# Altium schematic sheet MCU.SchDoc
size A3; SheetNumber: 3; SheetTotal: 7
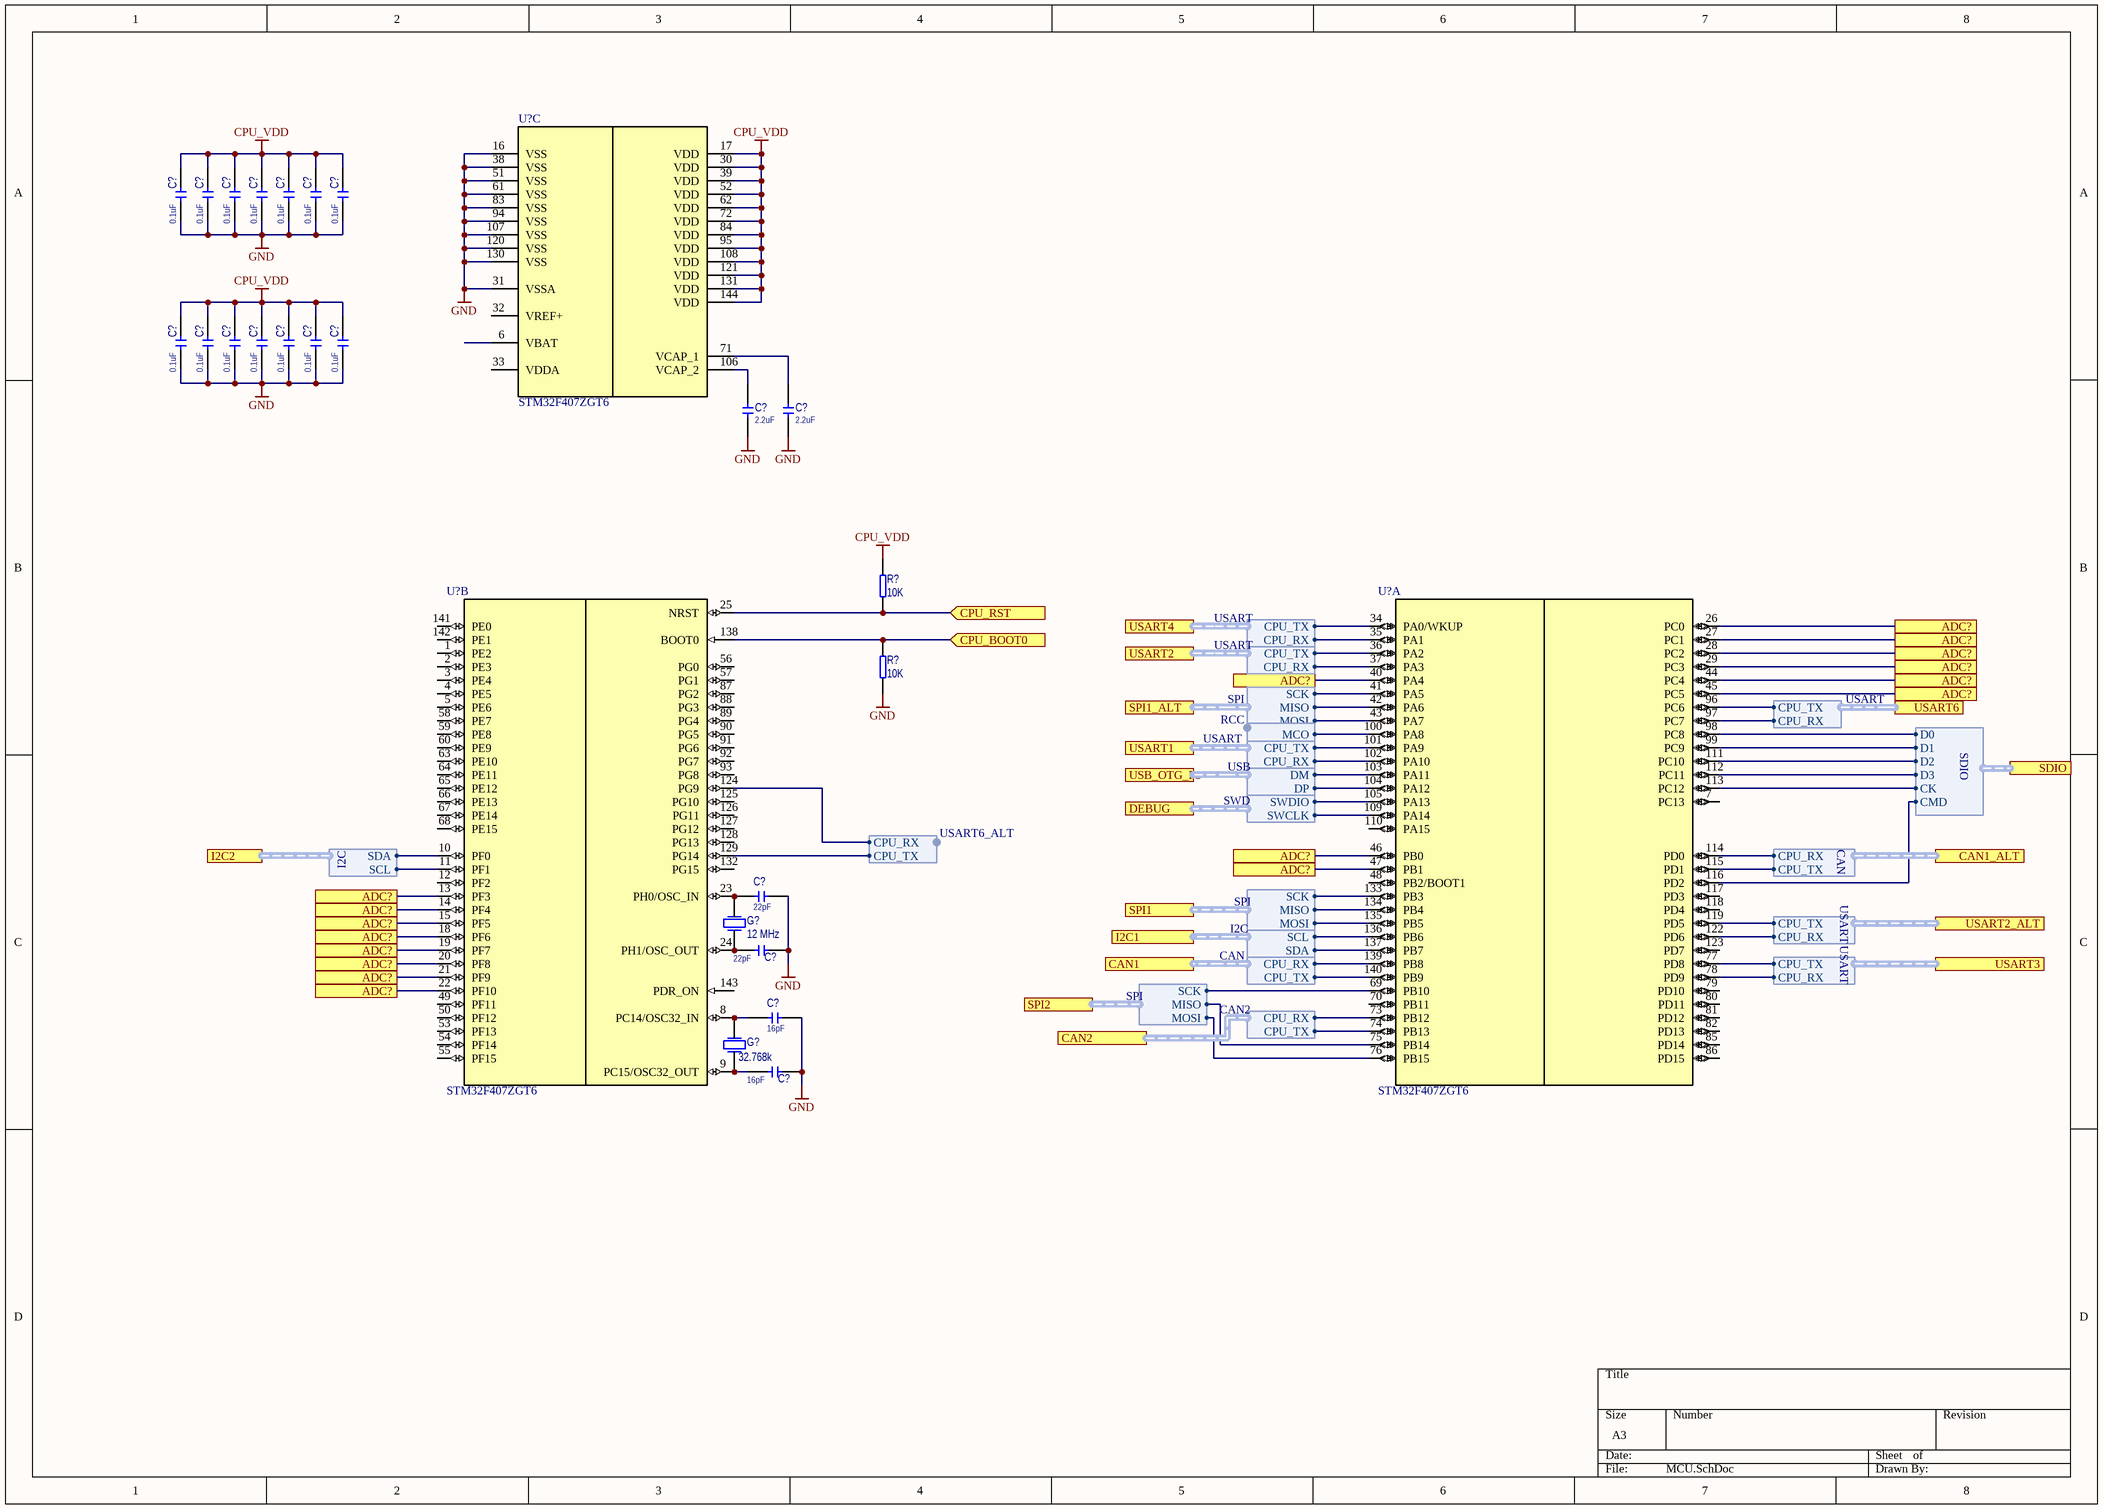
[diagram p0: MCU.SchDoc]

## Parts
(Parts that share a designator on the sheet are numbered #1, #2 ... from top to bottom, then left to right.)
C?#1  value 0.1uF  [CERCAP 0603]
C?#2  value 0.1uF  [CERCAP 0603]
C?#3  value 0.1uF  [CERCAP 0603]
C?#4  value 0.1uF  [CERCAP 0603]
C?#5  value 0.1uF  [CERCAP 0603]
C?#6  value 0.1uF  [CERCAP 0603]
C?#7  value 0.1uF  [CERCAP 0603]
C?#8  value 0.1uF  [CERCAP 0603]
C?#9  value 0.1uF  [CERCAP 0603]
C?#10  value 0.1uF  [CERCAP 0603]
C?#11  value 0.1uF  [CERCAP 0603]
C?#12  value 0.1uF  [CERCAP 0603]
C?#13  value 0.1uF  [CERCAP 0603]
C?#14  value 0.1uF  [CERCAP 0603]
C?#15  value 2.2uF  [CERCAP 0603]
C?#16  value 2.2uF  [CERCAP 0603]
C?#17  value 22pF  [CERCAP 0402]
C?#18  value 22pF  [CERCAP 0402]
C?#19  value 16pF  [CERCAP 0402]
C?#20  value 16pF  [CERCAP 0402]
G?#1  value 12 MHz  [3225]
G?#2  value 32.768k  [1210]
R?#1  value 10K  [RES 0402]
R?#2  value 10K  [RES 0402]
U?#1  STM32F407ZGT6  [LQFP-144]  (part C of 3)
U?#2  STM32F407ZGT6  [LQFP-144]  (part B of 3)
U?#3  STM32F407ZGT6  [LQFP-144]  (part A of 3)

## Ports
ADC?, CAN1 (harness CAN), CAN1_ALT (harness CAN), CAN2 (harness CAN2), CPU_BOOT0 (in), CPU_RST (in), DEBUG (harness SWD), I2C1 (harness I2C), I2C2 (harness I2C), SDIO (harness SDIO), SPI1 (harness SPI), SPI1_ALT (harness SPI), SPI2 (harness SPI), USART1 (harness USART), USART2 (harness USART), USART2_ALT (harness USART), USART3 (harness USART), USART4 (harness USART), USART6 (harness USART), USB_OTG_FS (harness USB)

## Harnesses
USART: CPU_TX, CPU_RX
SPI: SCK, MISO, MOSI
RCC: MCO
USB: DM, DP
SWD: SWDIO, SWCLK
I2C: SCL, SDA
CAN: CPU_RX, CPU_TX
CAN2: CPU_RX, CPU_TX
SDIO: D0, D1, D2, D3, CK, CMD
I2C: SDA, SCL
USART6_ALT: CPU_RX, CPU_TX

## Nets
CPU_VDD: C?#1.1 C?#2.1 C?#3.1 C?#4.1 C?#5.1 C?#6.1 C?#7.1 C?#8.1 C?#9.1 C?#10.1 C?#11.1 C?#12.1 C?#13.1 C?#14.1 R?#1.1 U?#1.17(VDD) U?#1.30(VDD) U?#1.39(VDD) U?#1.52(VDD) U?#1.62(VDD) U?#1.72(VDD) U?#1.84(VDD) U?#1.95(VDD) U?#1.108(VDD) U?#1.121(VDD) U?#1.131(VDD) U?#1.144(VDD)
GND: C?#1.2 C?#2.2 C?#3.2 C?#4.2 C?#5.2 C?#6.2 C?#7.2 C?#8.2 C?#9.2 C?#10.2 C?#11.2 C?#12.2 C?#13.2 C?#14.2 C?#15.2 C?#16.2 C?#17.2 C?#18.2 C?#19.2 C?#20.2 R?#2.1 U?#1.16(VSS) U?#1.31(VSSA) U?#1.38(VSS) U?#1.51(VSS) U?#1.61(VSS) U?#1.83(VSS) U?#1.94(VSS) U?#1.107(VSS) U?#1.120(VSS) U?#1.130(VSS)
ADC?: U?#2.13(PF3) U?#2.14(PF4) U?#2.15(PF5) U?#2.18(PF6) U?#2.19(PF7) U?#2.20(PF8) U?#2.21(PF9) U?#2.22(PF10) U?#3.26(PC0) U?#3.27(PC1) U?#3.28(PC2) U?#3.29(PC3) U?#3.40(PA4) U?#3.44(PC4) U?#3.45(PC5) U?#3.46(PB0) U?#3.47(PB1) ; port ADC?
CPU_BOOT0: R?#2.2 U?#2.138(BOOT0) ; port CPU_BOOT0
CPU_RST: R?#1.2 U?#2.25(NRST) ; port CPU_RST
NetC?#15_1: C?#15.1 U?#1.106(VCAP_2)
NetC?#16_1: C?#16.1 U?#1.71(VCAP_1)
NetC?#17_1: C?#17.1 G?#1.1 U?#2.23(PH0/OSC_IN)
NetC?#18_1: C?#18.1 G?#1.2 U?#2.24(PH1/OSC_OUT)
NetC?#19_1: C?#19.1 G?#2.1 U?#2.8(PC14/OSC32_IN)
NetC?#20_1: C?#20.1 G?#2.2 U?#2.9(PC15/OSC32_OUT)
NetU?#2_10: U?#2.10(PF0) ; port I2C2.SDA
NetU?#2_11: U?#2.11(PF1) ; port I2C2.SCL
NetU?#2_124: U?#2.124(PG9) ; harness USART6_ALT.CPU_RX
NetU?#2_129: U?#2.129(PG14) ; harness USART6_ALT.CPU_TX
NetU?#3_34: U?#3.34(PA0/WKUP) ; port USART4.CPU_TX
NetU?#3_35: U?#3.35(PA1) ; port USART4.CPU_RX
NetU?#3_36: U?#3.36(PA2) ; port USART2.CPU_TX
NetU?#3_37: U?#3.37(PA3) ; port USART2.CPU_RX
NetU?#3_41: U?#3.41(PA5) ; port SPI1_ALT.SCK
NetU?#3_42: U?#3.42(PA6) ; port SPI1_ALT.MISO
NetU?#3_43: U?#3.43(PA7) ; port SPI1_ALT.MOSI
NetU?#3_69: U?#3.69(PB10) ; port SPI2.SCK
NetU?#3_73: U?#3.73(PB12) ; port CAN2.CPU_RX
NetU?#3_74: U?#3.74(PB13) ; port CAN2.CPU_TX
NetU?#3_75: U?#3.75(PB14) ; port SPI2.MISO
NetU?#3_76: U?#3.76(PB15) ; port SPI2.MOSI
NetU?#3_77: U?#3.77(PD8) ; port USART3.CPU_TX
NetU?#3_78: U?#3.78(PD9) ; port USART3.CPU_RX
NetU?#3_96: U?#3.96(PC6) ; port USART6.CPU_TX
NetU?#3_97: U?#3.97(PC7) ; port USART6.CPU_RX
NetU?#3_98: U?#3.98(PC8) ; port SDIO.D0
NetU?#3_99: U?#3.99(PC9) ; port SDIO.D1
NetU?#3_100: U?#3.100(PA8) ; harness RCC.MCO
NetU?#3_101: U?#3.101(PA9) ; port USART1.CPU_TX
NetU?#3_102: U?#3.102(PA10) ; port USART1.CPU_RX
NetU?#3_103: U?#3.103(PA11) ; port USB_OTG_FS.DM
NetU?#3_104: U?#3.104(PA12) ; port USB_OTG_FS.DP
NetU?#3_105: U?#3.105(PA13) ; port DEBUG.SWDIO
NetU?#3_109: U?#3.109(PA14) ; port DEBUG.SWCLK
NetU?#3_111: U?#3.111(PC10) ; port SDIO.D2
NetU?#3_112: U?#3.112(PC11) ; port SDIO.D3
NetU?#3_113: U?#3.113(PC12) ; port SDIO.CK
NetU?#3_114: U?#3.114(PD0) ; port CAN1_ALT.CPU_RX
NetU?#3_115: U?#3.115(PD1) ; port CAN1_ALT.CPU_TX
NetU?#3_116: U?#3.116(PD2) ; port SDIO.CMD
NetU?#3_119: U?#3.119(PD5) ; port USART2_ALT.CPU_TX
NetU?#3_122: U?#3.122(PD6) ; port USART2_ALT.CPU_RX
NetU?#3_133: U?#3.133(PB3) ; port SPI1.SCK
NetU?#3_134: U?#3.134(PB4) ; port SPI1.MISO
NetU?#3_135: U?#3.135(PB5) ; port SPI1.MOSI
NetU?#3_136: U?#3.136(PB6) ; port I2C1.SCL
NetU?#3_137: U?#3.137(PB7) ; port I2C1.SDA
NetU?#3_139: U?#3.139(PB8) ; port CAN1.CPU_RX
NetU?#3_140: U?#3.140(PB9) ; port CAN1.CPU_TX

Not connected (* = marked no-connect by the designer): U?#1 6(VBAT) 32(VREF+) 33(VDDA); U?#2 1(PE2) 2(PE3) 3(PE4) 4(PE5) 5(PE6) 12(PF2) 49(PF11) 50(PF12) 53(PF13) 54(PF14) 55(PF15) 56(PG0) 57(PG1) 58(PE7) 59(PE8) 60(PE9) 63(PE10) 64(PE11) 65(PE12) 66(PE13) 67(PE14) 68(PE15) 87(PG2) 88(PG3) 89(PG4) 90(PG5) 91(PG6) 92(PG7) 93(PG8) 125(PG10) 126(PG11) 127(PG12) 128(PG13) 132(PG15) 141(PE0) 142(PE1) 143(PDR_ON); U?#3 7(PC13) 48(PB2/BOOT1) 70(PB11) 79(PD10) 80(PD11) 81(PD12) 82(PD13) 85(PD14) 86(PD15) 110(PA15) 117(PD3) 118(PD4) 123(PD7)

## Library data of the parts
C?#1-C?#20 = !Capacitor: Capacitor; IsSMT: NoSMT; Diel: X7R; Voltage: *
G?#1 = Crystal: pin to pad: 2>3; IsSMT: NoSMT
G?#2 = Crystal: IsSMT: NoSMT
R?#1 R?#2 = !Resistor: Resistor; IsSMT: NoSMT
U?#1-U?#3 = STM32F407ZGT6: Coretx-M4